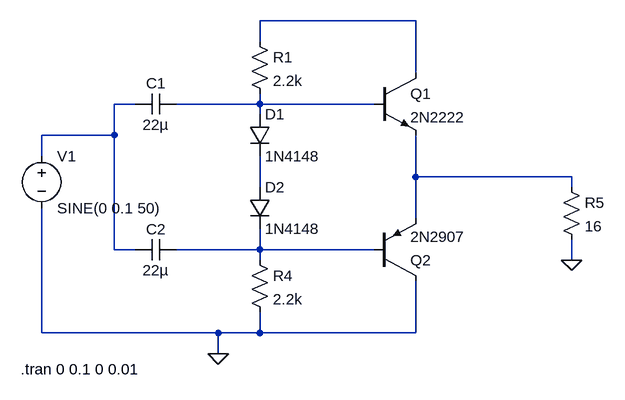
[diagram p0: schematic ab amp.asc]
ab amp.asc, the LTspice schematic file:
Version 4
SHEET 1 880 680
WIRE 432 -16 192 -16
WIRE 192 16 192 -16
WIRE 432 64 432 -16
WIRE 0 112 -32 112
WIRE 192 112 192 96
WIRE 192 112 64 112
WIRE 368 112 192 112
WIRE 192 128 192 112
WIRE -32 160 -32 112
WIRE -32 160 -144 160
WIRE -144 192 -144 160
WIRE 432 224 432 160
WIRE 672 224 432 224
WIRE 192 240 192 192
WIRE 672 240 672 224
WIRE 432 288 432 224
WIRE -32 336 -32 160
WIRE 0 336 -32 336
WIRE 192 336 192 304
WIRE 192 336 64 336
WIRE 368 336 192 336
WIRE 192 352 192 336
WIRE 672 352 672 320
WIRE -144 464 -144 272
WIRE 128 464 -144 464
WIRE 192 464 192 432
WIRE 192 464 128 464
WIRE 432 464 432 384
WIRE 432 464 192 464
WIRE 128 496 128 464
FLAG 128 496 0
FLAG 672 352 0
SYMBOL res 176 0 R0
SYMATTR InstName R1
SYMATTR Value 2.2k
SYMBOL res 176 336 R0
SYMATTR InstName R4
SYMATTR Value 2.2k
SYMBOL cap 64 96 R90
WINDOW 0 0 32 VBottom 2
WINDOW 3 32 32 VTop 2
SYMATTR InstName C1
SYMATTR Value 22µ
SYMBOL cap 64 320 R90
WINDOW 0 0 32 VBottom 2
WINDOW 3 32 32 VTop 2
SYMATTR InstName C2
SYMATTR Value 22µ
SYMBOL npn 368 64 R0
SYMATTR InstName Q1
SYMATTR Value 2N2222
SYMBOL pnp 368 384 M180
SYMATTR InstName Q2
SYMATTR Value 2N2907
SYMBOL res 656 224 R0
SYMATTR InstName R5
SYMATTR Value 16
SYMBOL voltage -144 176 R0
WINDOW 123 0 0 Left 0
WINDOW 39 0 0 Left 0
SYMATTR InstName V1
SYMATTR Value SINE(0 0.1 50)
SYMBOL diode 176 128 R0
SYMATTR InstName D1
SYMATTR Value 1N4148
SYMBOL diode 176 240 R0
SYMATTR InstName D2
SYMATTR Value 1N4148
TEXT -176 520 Left 2 !.tran 0 0.1 0 0.01

The netlist it stands for:
* ab amp.asc
R1 N001 N003 2.2k
R4 N006 0 2.2k
C1 N003 N002 22µ
C2 N006 N002 22µ
Q1 N001 N003 N004 0 2N2222
Q2 0 N006 N004 0 2N2907
R5 N004 0 16
V1 N002 0 SINE(0 0.1 50)
D1 N003 N005 1N4148
D2 N005 N006 1N4148
.model D D
.lib standard.dio
.model NPN NPN
.model PNP PNP
.lib standard.bjt
.tran 0 0.1 0 0.01
.backanno
.end